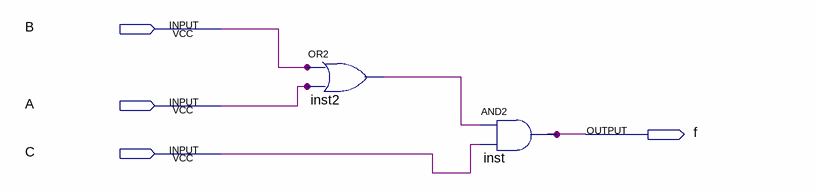
[diagram p0: schematic sheet]
// Quartus schematic Lab3Q1.bdf as structural Verilog: 2 symbols, 4 pins
module Lab3Q1 (
  input  B,
  input  A,
  input  C,
  output f
);

  wire inst2_out;

  or inst2 (inst2_out, B, A);
  and inst (f, inst2_out, C);
endmodule
